# Altium schematic sheet LEDs and Buttons.SchDoc
size A; SheetNumber: 2; SheetTotal: 2
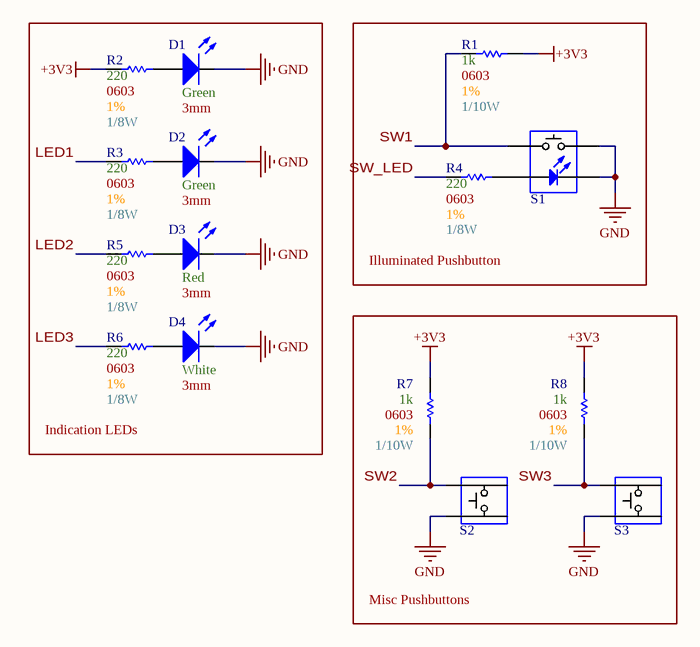
[diagram p0: LEDs and Buttons.SchDoc]

## Parts
D1  Color: Green  Lens Diameter: 3mm  [[LED] Thru-Hole 3mm]  (hidden comment: [LED] Thru-Hole 3mm Green)
D2  Color: Green  Lens Diameter: 3mm  [[LED] Thru-Hole 3mm]  (hidden comment: [LED] Thru-Hole 3mm Green)
D3  Color: Red  Lens Diameter: 3mm  [[LED] Thru-Hole 3mm]  (hidden comment: [LED] Thru-Hole 3mm Red)
D4  Color: White  Lens Diameter: 3mm  [[LED] Thru-Hole 3mm]  (hidden comment: [LED] Thru-Hole 3mm White)
R1  Wattage: 1/10W  Tolerance: 1%  Resistance: 1k  Size Package: 0603  [[Res] SMD 0603]  (hidden comment: [1k] SMD 0603 1% 1/10W)
R2  Wattage: 1/8W  Tolerance: 1%  Resistance: 220  Size Package: 0603  [[Res] SMD 0603]  (hidden comment: [220] SMD 0603 1% 1/10W)
R3  Wattage: 1/8W  Tolerance: 1%  Resistance: 220  Size Package: 0603  [[Res] SMD 0603]  (hidden comment: [220] SMD 0603 1% 1/10W)
R4  Wattage: 1/8W  Tolerance: 1%  Resistance: 220  Size Package: 0603  [[Res] SMD 0603]  (hidden comment: [220] SMD 0603 1% 1/10W)
R5  Wattage: 1/8W  Tolerance: 1%  Resistance: 220  Size Package: 0603  [[Res] SMD 0603]  (hidden comment: [220] SMD 0603 1% 1/10W)
R6  Wattage: 1/8W  Tolerance: 1%  Resistance: 220  Size Package: 0603  [[Res] SMD 0603]  (hidden comment: [220] SMD 0603 1% 1/10W)
R7  Wattage: 1/10W  Tolerance: 1%  Resistance: 1k  Size Package: 0603  [[Res] SMD 0603]  (hidden comment: [1k] SMD 0603 1% 1/10W)
R8  Wattage: 1/10W  Tolerance: 1%  Resistance: 1k  Size Package: 0603  [[Res] SMD 0603]  (hidden comment: [1k] SMD 0603 1% 1/10W)
S1  [SPST] Illuminated Red Pushbutton  [[SPST] Illuminated Red Pushbutton]  (value not drawn)
S2  Standard pushbutton  [[SPST] Pushbutton]  (value not drawn)
S3  Standard pushbutton  [[SPST] Pushbutton]  (value not drawn)

## Blocks framed on the sheet
Indication LEDs: D1-D4 R2 R3 R5 R6
Illuminated Pushbutton: R1 R4 S1
Misc Pushbuttons: R7 R8 S2 S3

## Nets
+3V3: R1.1 R2.1 R7.1 R8.1
GND: D1.2(Cathode) D2.2(Cathode) D3.2(Cathode) D4.2(Cathode) S1.2(COM_1) S1.6(K) S2.2 S3.2
LED1: R3.1
LED2: R5.1
LED3: R6.1
SW1: R1.2 S1.1(NO_1)
SW2: R7.2 S2.1
SW3: R8.2 S3.1
SW_LED: R4.1
NetD1_1: D1.1(Anode) R2.2
NetD2_1: D2.1(Anode) R3.2
NetD3_1: D3.1(Anode) R5.2
NetD4_1: D4.1(Anode) R6.2
NetR4_2: R4.2 S1.5(A)

## Library data of the parts
D1 D2 = [LED] Thru-Hole 3mm Green: 151031VS06000; Supplier 1: DigiKey; Supplier Part Number 1: 732-5008-ND
D3 = [LED] Thru-Hole 3mm Red: 151031SS06000; Supplier 1: DigiKey; Supplier Part Number 1: 732-5006-ND
D4 = [LED] Thru-Hole 3mm White: 151031VS06000; Supplier 1: DigiKey; Supplier Part Number 1: 1516-QBL7IW60D-WW-ND
R1 R7 R8 = [1k] SMD 0603 1% 1/10W: RMCF0603FT1K00; Supplier 1: DigiKey; Supplier Part Number 1: RMCF0603FT1K00DKR-ND
R2-R6 = [220] SMD 0603 1% 1/10W: CRGCQ0805F220R; Supplier 1: DigiKey; Supplier Part Number 1: A129741CT-ND
S1 = [SPST] Illuminated Red Pushbutton: B3W-9010-R1N; Supplier 1: DigiKey; Supplier Part Number 1: SW1111-ND
S2 S3 = [SPST] Pushbutton: Supplier 1: DigiKey; Supplier Part Number 1: 450-1650-ND